# EAGLE schematic amyboardr4 (EAGLE 9.6.2)
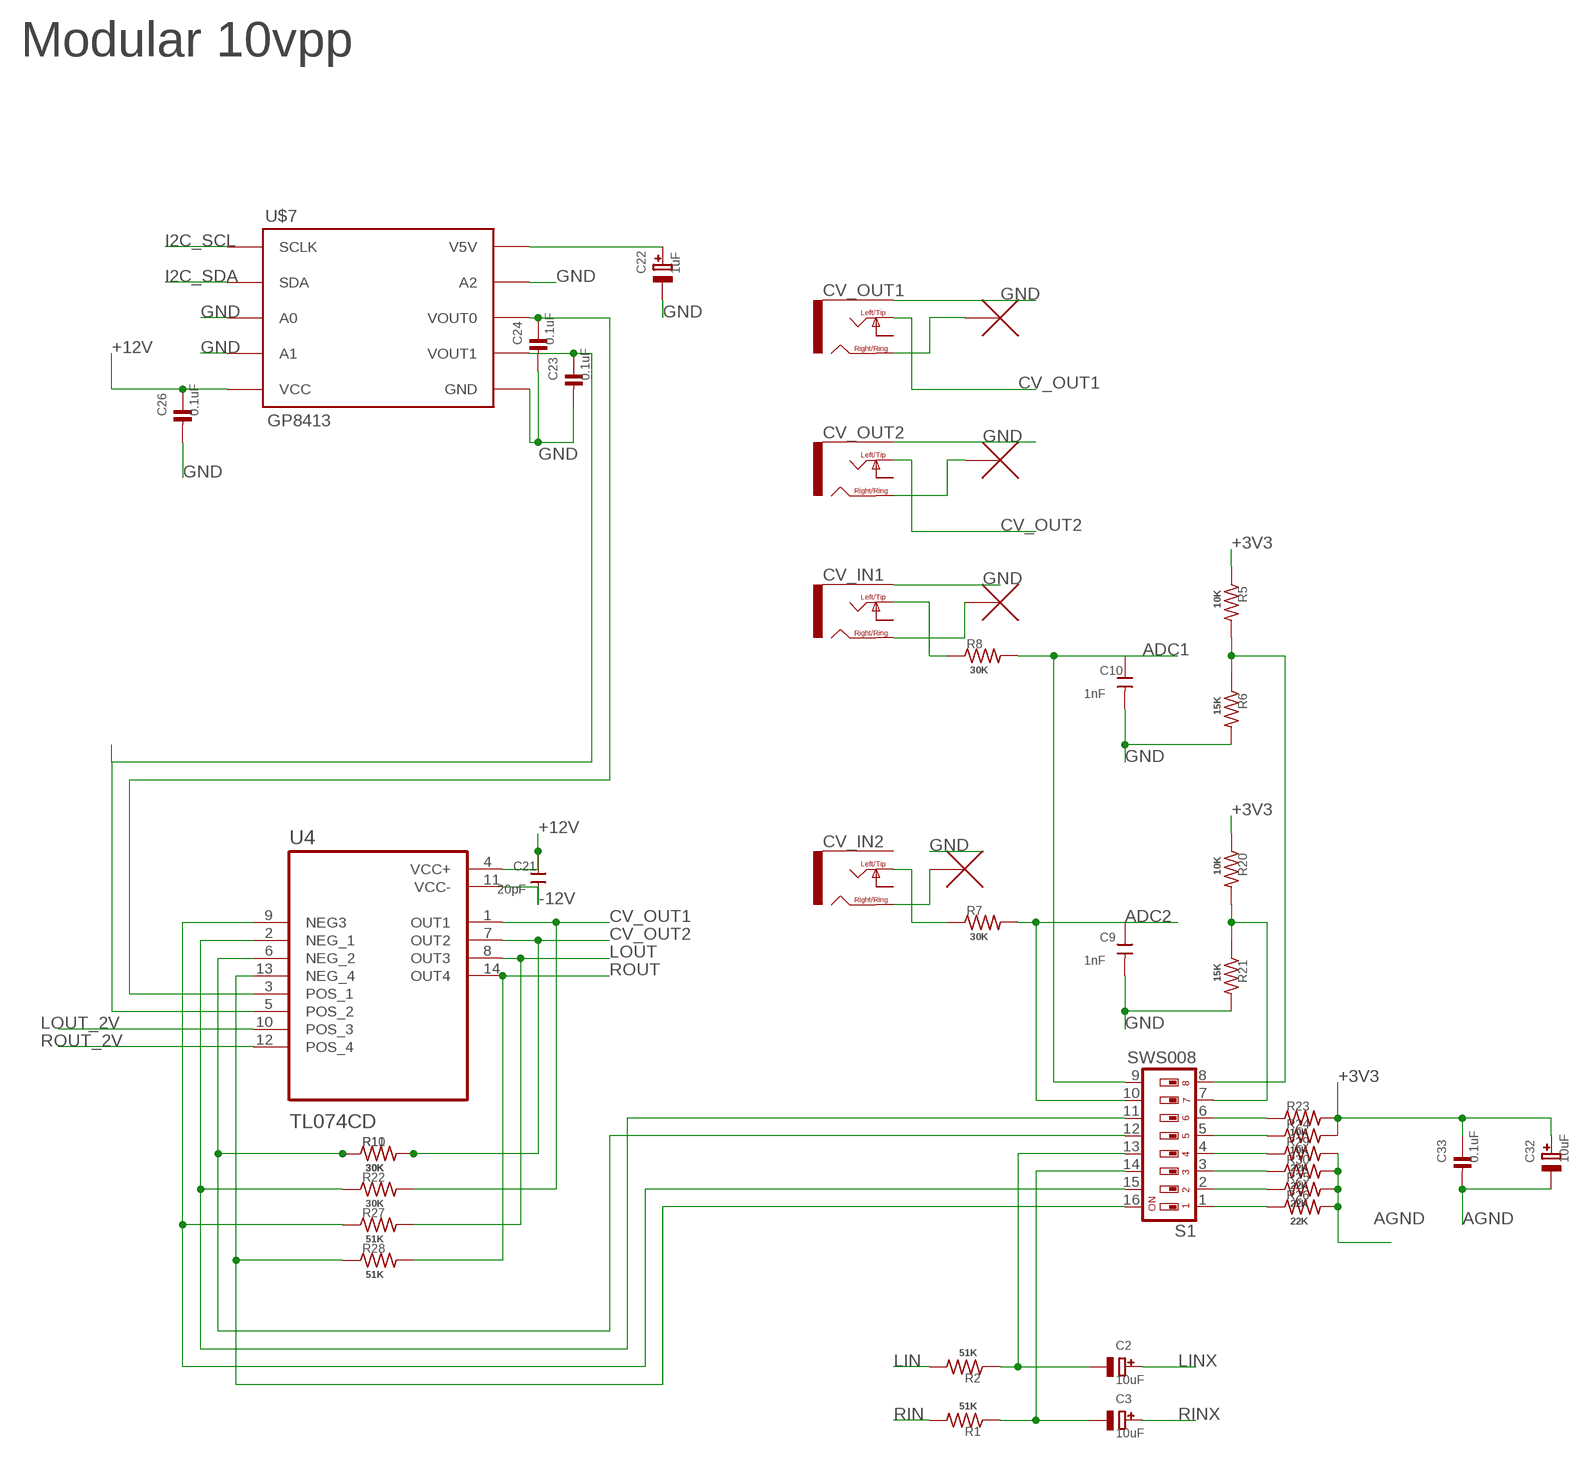
[diagram p0: schematic, sheet 1, part 1 of 2]
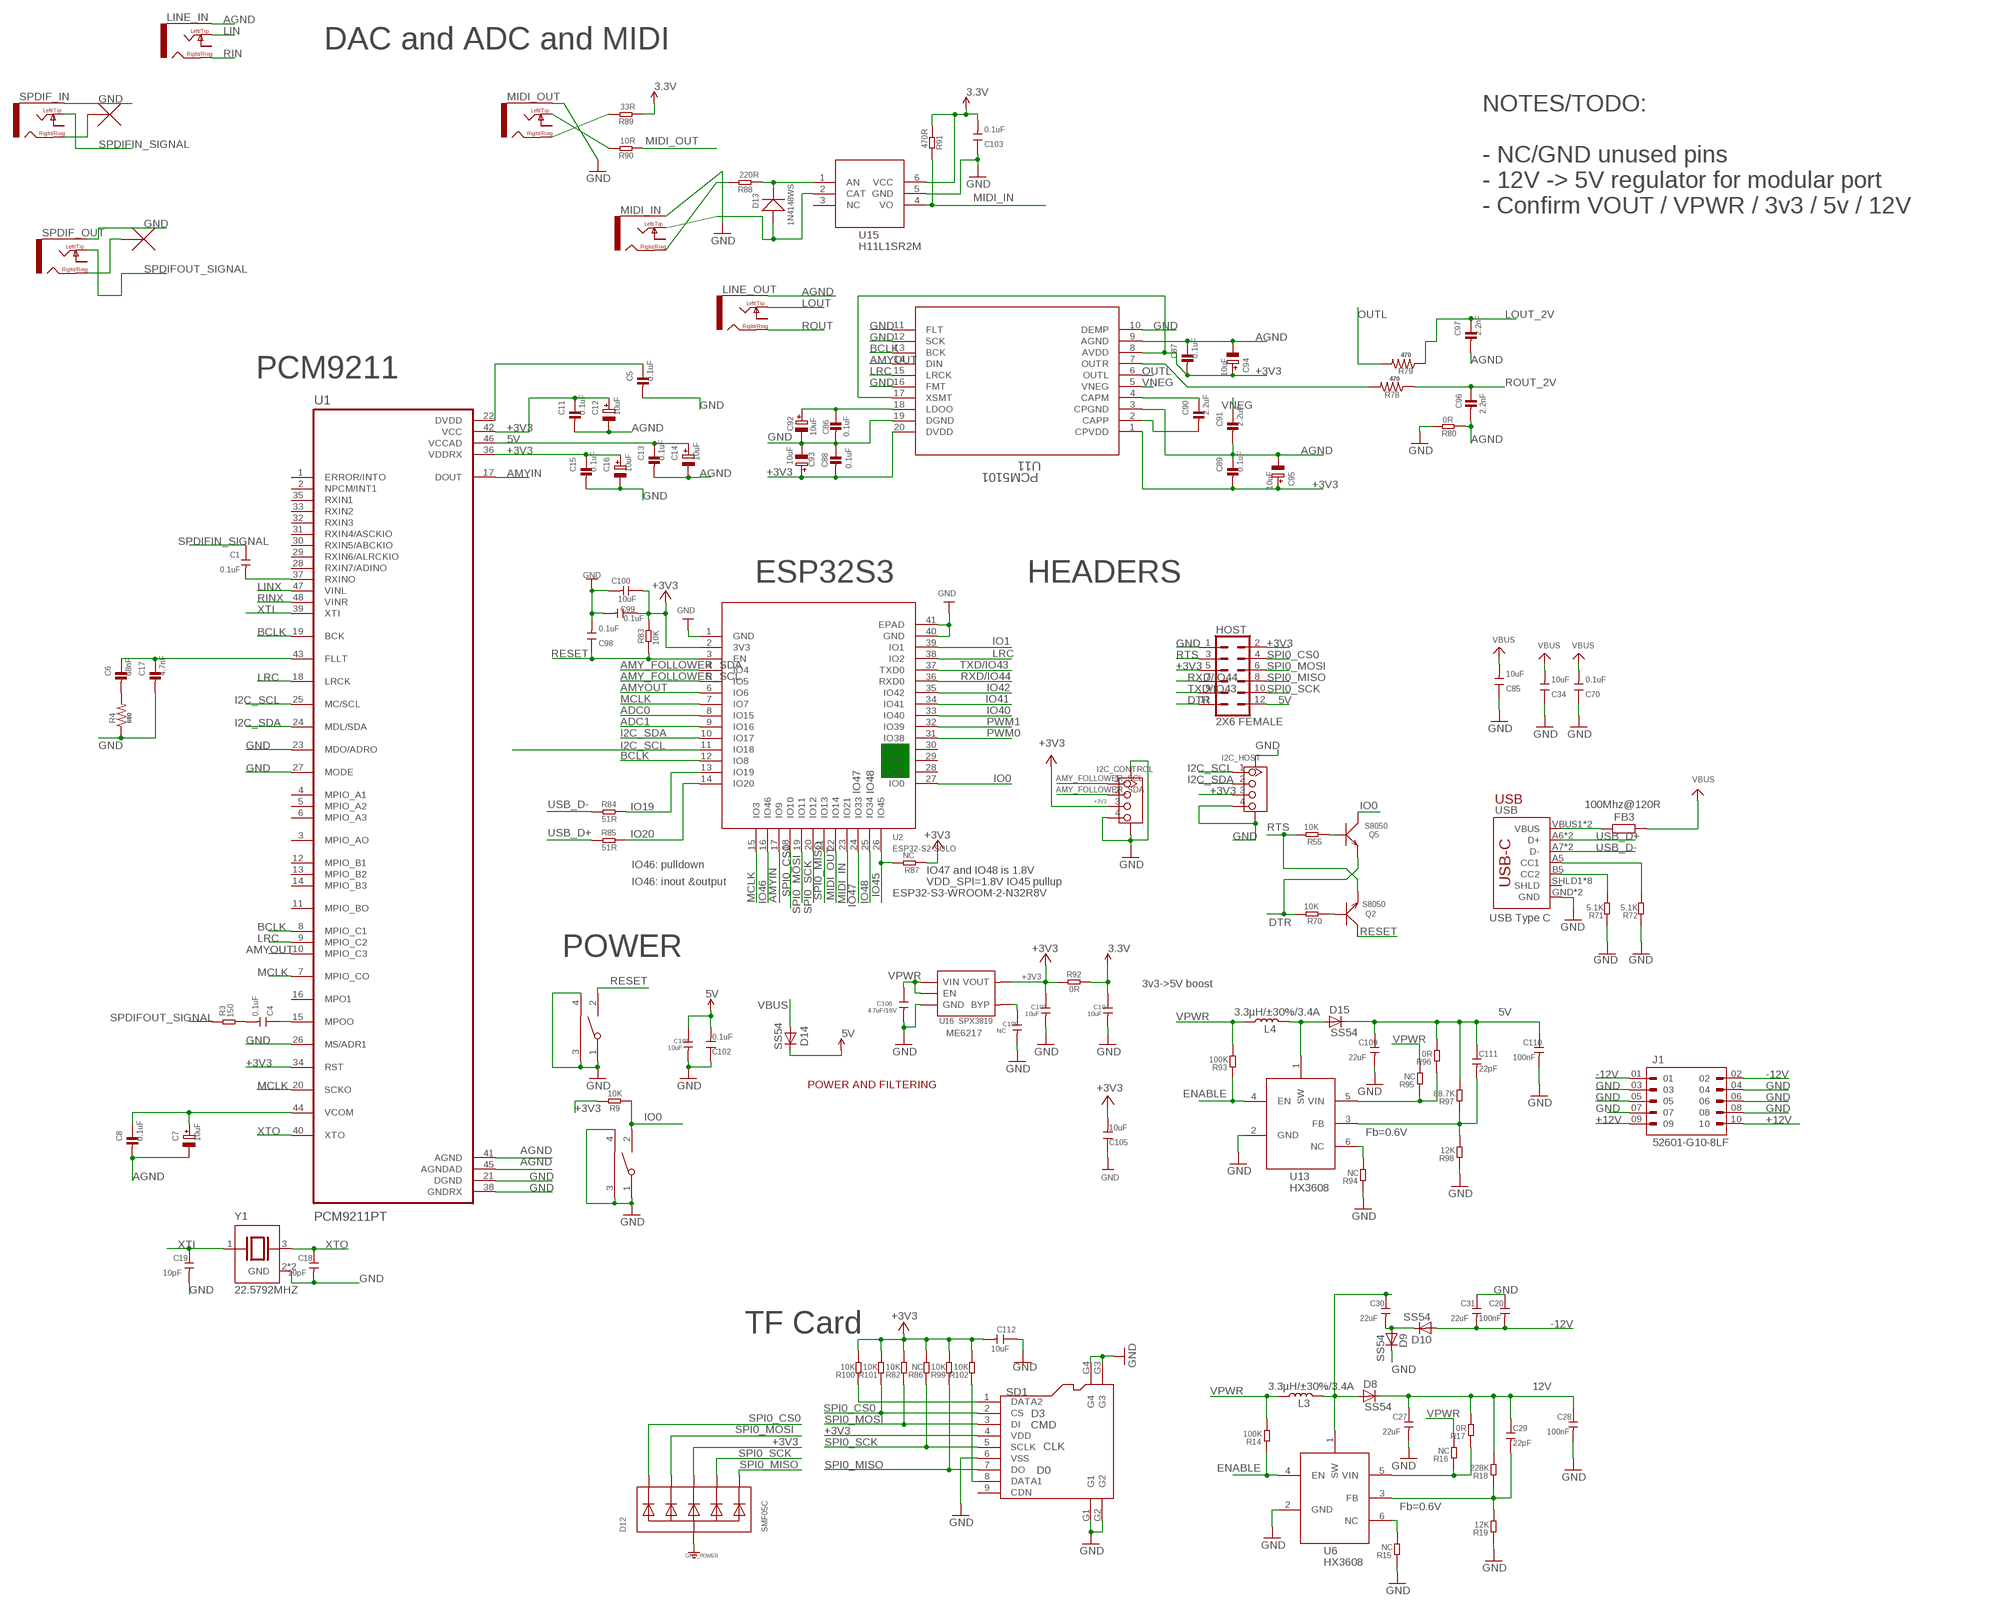
[diagram p1: schematic, sheet 1, part 2 of 2]

## Parts
BOOT  TS24CA  [2*4*3.5MM]
C1  0.1uF  CAP-0603  [C0603]
C2  10uF  CAP_ELECTROLYTICPANASONIC_C  [PANASONIC_C]
C3  10uF  CAP_ELECTROLYTICPANASONIC_C  [PANASONIC_C]
C4  0.1uF  CAP-0603  [C0603]
C5  0.1uF  CAP_CERAMIC0805-NOOUTLINE  [0805-NO@1]
C6  68nF  CAP_CERAMIC0805-NOOUTLINE  [0805-NO@1]
C7  10uF  CAP_ELECTROLYTICPANASONIC_C  [PANASONIC_C]
C8  0.1uF  CAP_CERAMIC0805-NOOUTLINE  [0805-NO@1]
C9  1nF  CAP-0603  [C0603]
C10  1nF  CAP-0603  [C0603]
C11  0.1uF  CAP_CERAMIC0805-NOOUTLINE  [0805-NO@1]
C12  10uF  CAP_ELECTROLYTICPANASONIC_C  [PANASONIC_C]
C13  0.1uF  CAP_CERAMIC0805-NOOUTLINE  [0805-NO@1]
C14  10uF  CAP_ELECTROLYTICPANASONIC_C  [PANASONIC_C]
C15  0.1uF  CAP_CERAMIC0805-NOOUTLINE  [0805-NO@1]
C16  10uF  CAP_ELECTROLYTICPANASONIC_C  [PANASONIC_C]
C17  4.7nF  CAP_CERAMIC0805-NOOUTLINE  [0805-NO@1]
C18  10pF  CAP-0603  [C0603]
C19  10pF  CAP-0603  [C0603]
C20  100nF  CAP-0603  [C0603]
C21  20pF  CAP-0603  [C0603]
C22  1uF  CAP_ELECTROLYTICPANASONIC_C  [PANASONIC_C]
C23  0.1uF  CAP_CERAMIC0805-NOOUTLINE  [0805-NO@1]
C24  0.1uF  CAP_CERAMIC0805-NOOUTLINE  [0805-NO@1]
C26  0.1uF  CAP_CERAMIC0805-NOOUTLINE  [0805-NO@1]
C27  22uF  CAP-0603  [C0603]
C28  100nF  CAP-0603  [C0603]
C29  22pF  CAP-0603  [C0603]
C30  22uF  CAP-0603  [C0603]
C31  22uF  CAP-0603  [C0603]
C32  10uF  CAP_ELECTROLYTICPANASONIC_C  [PANASONIC_C]
C33  0.1uF  CAP_CERAMIC0805-NOOUTLINE  [0805-NO@1]
C34  10uF  DISCRETE_C-0603  [DISCRETE_C0603]
C70  0.1uF  DISCRETE_C-0603  [DISCRETE_C0603]
C85  10uF  DISCRETE_C-0603  [DISCRETE_C0603]
C86  0.1uF  CAP_CERAMIC0805-NOOUTLINE  [0805-NO@1]
C87  0.1uF  CAP_CERAMIC0805-NOOUTLINE  [0805-NO@1]
C88  0.1uF  CAP_CERAMIC0805-NOOUTLINE  [0805-NO@1]
C89  0.1uF  CAP_CERAMIC0805-NOOUTLINE  [0805-NO@1]
C90  2.2uF  CAP_CERAMIC0805-NOOUTLINE  [0805-NO@1]
C91  2.2uF  CAP_CERAMIC0805-NOOUTLINE  [0805-NO@1]
C92  10uF  CAP_ELECTROLYTICPANASONIC_C  [PANASONIC_C]
C93  10uF  CAP_ELECTROLYTICPANASONIC_C  [PANASONIC_C]
C94  10uF  CAP_ELECTROLYTICPANASONIC_C  [PANASONIC_C]
C95  10uF  CAP_ELECTROLYTICPANASONIC_C  [PANASONIC_C]
C96  2.2nF  CAP_CERAMIC0805-NOOUTLINE  [0805-NO@1]
C97  2.2nF  CAP_CERAMIC0805-NOOUTLINE  [0805-NO@1]
C98  0.1uF  DISCRETE_C-0603  [DISCRETE_C0603]
C99  0.1uF  DISCRETE_C-0603  [DISCRETE_C0603]
C100  10uF  DISCRETE_C-0603  [DISCRETE_C0603]
C101  10uF  C-0603  [0603]
C102  0.1uF  DISCRETE_C-0603  [DISCRETE_C0603]
C103  0.1uF  DISCRETE_C-0603  [DISCRETE_C0603]
C104  10uF  C-0603  [0603]
C105  10uF  DISCRETE_C-0603  [DISCRETE_C0603]
C106  4.7uF/16V  C-0603  [0603]
C107  10uF  C-0603  [0603]
C108  NC  C-0603  [0603]
C109  22uF  CAP-0603  [C0603]
C110  100nF  CAP-0603  [C0603]
C111  22pF  CAP-0603  [C0603]
C112  10uF  DISCRETE_C-0603  [DISCRETE_C0603]
CV_IN1  NV-PJ3410_STEREO  [NV-PJ3410_SOCKET]
CV_IN2  NV-PJ3410_STEREO  [NV-PJ3410_SOCKET]
CV_OUT1  NV-PJ3410_STEREO  [NV-PJ3410_SOCKET]
CV_OUT2  NV-PJ3410_STEREO  [NV-PJ3410_SOCKET]
D8  SS54  DIODE-DO-214AC  [DO-214AC]
D9  SS54  DIODE-DO-214AC  [DO-214AC]
D10  SS54  DIODE-DO-214AC  [DO-214AC]
D12  SMF05C  TVSARRAY_5LANE  [SOT363]
D13  1N4148WS  D'0805'  [SOD323]
D14  SS54  DIODE-DO-214AC  [DO-214AC]
D15  SS54  DIODE-DO-214AC  [DO-214AC]
FB3  100Mhz@120R  R-EU_R0805  [R0805]
HOST  2X6 FEMALE  CONN_06X2PTH_FEMALE  [2X6]
I2C_CONTROL  GROVE-CONNECTOR-SMD'90D'  [HW4-SMD-2.0-90D]
I2C_HOST  GROVE-CONNECTOR-SMD'90D'  [HW4-SMD-2.0-90D]
J1  52601-G10-8LF  [AMPHENOL_52601-G10-8LF]
L3  3.3µH/±30%/3.4A  INDUCTOR-CR54-3.3UH  [CR54]
L4  3.3µH/±30%/3.4A  INDUCTOR-CR54-3.3UH  [CR54]
LINE_IN  NV-PJ3410_STEREO  [NV-PJ3410_SOCKET]
LINE_OUT  NV-PJ3410_STEREO  [NV-PJ3410_SOCKET]
MIDI_IN  NV-PJ3410_STEREO  [NV-PJ3410_SOCKET]
MIDI_OUT  NV-PJ3410_STEREO  [NV-PJ3410_SOCKET]
PCM5101  U11  PCM5101APW  [PW20_TEX]
Q2  S8050  TRANSISTOR-NPN-SOT23  [SOT23]
Q5  S8050  TRANSISTOR-NPN-SOT23  [SOT23]
R1  51K  R-US_R0805  [R0805]
R2  51K  R-US_R0805  [R0805]
R3  150  DISCRETE_R-0603  [DISCRETE_R0603]
R4  680  R-US_R0805  [R0805]
R5  10K  R-US_R0805  [R0805]
R6  15K  R-US_R0805  [R0805]
R7  30K  R-US_R0805  [R0805]
R8  30K  R-US_R0805  [R0805]
R9  10K  R-0603  [R0603]
R10  30K  R-US_R0805  [R0805]
R11  30K  R-US_R0805  [R0805]
R14  100K  DISCRETE_R-0603  [DISCRETE_R0603]
R15  NC  DISCRETE_R-0603  [DISCRETE_R0603]
R16  NC  DISCRETE_R-0603  [DISCRETE_R0603]
R17  0R  DISCRETE_R-0603  [DISCRETE_R0603]
R18  228K  DISCRETE_R-0603  [DISCRETE_R0603]
R19  12K  DISCRETE_R-0603  [DISCRETE_R0603]
R20  10K  R-US_R0805  [R0805]
R21  15K  R-US_R0805  [R0805]
R22  30K  R-US_R0805  [R0805]
R23  10K  R-US_R0805  [R0805]
R24  10K  R-US_R0805  [R0805]
R25  22K  R-US_R0805  [R0805]
R26  22K  R-US_R0805  [R0805]
R27  51K  R-US_R0805  [R0805]
R28  51K  R-US_R0805  [R0805]
R29  22K  R-US_R0805  [R0805]
R30  22K  R-US_R0805  [R0805]
R55  10K  R-0603  [R0603]
R70  10K  R-0603  [R0603]
R71  5.1K  DISCRETE_R-0603  [DISCRETE_R0603]
R72  5.1K  DISCRETE_R-0603  [DISCRETE_R0603]
R78  470  R-US_R0805  [R0805]
R79  470  R-US_R0805  [R0805]
R80  0R  DISCRETE_R-0603  [DISCRETE_R0603]
R82  10K  DISCRETE_R-0603  [DISCRETE_R0603]
R83  10K  R-0603  [R0603]
R84  51R  R-0603  [R0603]
R85  51R  R-0603  [R0603]
R86  NC  DISCRETE_R-0603  [DISCRETE_R0603]
R87  NC  R-0603  [R0603]
R88  220R  R-0603  [R0603]
R89  33R  R-0603  [R0603]
R90  10R  R-0603  [R0603]
R91  470R  R-0603  [R0603]
R92  0R  R-0603  [R0603]
R93  100K  DISCRETE_R-0603  [DISCRETE_R0603]
R94  NC  DISCRETE_R-0603  [DISCRETE_R0603]
R95  NC  DISCRETE_R-0603  [DISCRETE_R0603]
R96  0R  DISCRETE_R-0603  [DISCRETE_R0603]
R97  88.7K  DISCRETE_R-0603  [DISCRETE_R0603]
R98  12K  DISCRETE_R-0603  [DISCRETE_R0603]
R99  10K  DISCRETE_R-0603  [DISCRETE_R0603]
R100  10K  DISCRETE_R-0603  [DISCRETE_R0603]
R101  10K  DISCRETE_R-0603  [DISCRETE_R0603]
R102  10K  DISCRETE_R-0603  [DISCRETE_R0603]
RST  TS24CA  [2*4*3.5MM]
S1  SWS008  [SMS-008]
SD1  HOLDER-MICROSD-9P  [9P-SMD-W/-RING]
SPDIF_IN  NV-PJ3410_STEREO  [NV-PJ3410_SOCKET]
SPDIF_OUT  NV-PJ3410_STEREO  [NV-PJ3410_SOCKET]
U1  PCM9211PT  [QFP50P900X900X160-48N]
U2  ESP32­S2­SOLO  [ESP32-­S2-­SOLO]
U4  TL074CD  [SOIC127P600X175-14N]
U6  HX3608  [SOT-23-6]
U13  HX3608  [SOT-23-6]
U15  H11L1SR2M  [SOP-6-2.54MM]
U16  SPX3819  [SOT23-5]
U$1  NC_MARKER  (no package)
U$2  NC_MARKER  (no package)
U$3  NC_MARKER  (no package)
U$4  NC_MARKER  (no package)
U$5  NC_MARKER  (no package)
U$6  NC_MARKER  (no package)
U$7  GP8413  [SOIC-10]
USB  USB_C5  [USB-C-16P-5]
Y1  22.5792MHZ  ABM10W-22.5792MHZ-8-K1Z-T3  [XTAL_ABM10W-22.5792MHZ-8-K1Z-T3]

## Nets
3.3V: C103.2 C104.1 R89.1 R91.1 R92.2 U15.6(VCC)
5V: C13.1 C14.+ C101.1 C102.2 C109.1 C110.1 C111.1 D14.C D15.C HOST.12 R96.2 R97.2 U1.46(VCCAD)
12V: C27.1 C28.1 C29.1 D8.C R17.2 R18.2
+3V3: C5.1 C11.1 C12.+ C15.1 C16.+ C32.+ C33.1 C87.2 C88.2 C89.2 C93.+ C94.+ C95.+ C99.1 C100.1 C105.2 C107.1 C112.2 D12.4(C3) HOST.2 HOST.5 I2C_CONTROL.3 I2C_HOST.3 PCM5101.1(CPVDD) PCM5101.8(AVDD) PCM5101.17(XSMT) PCM5101.20(DVDD) R5.1 R9.2 R20.1 R23.2 R24.2 R82.2 R83.2 R86.2 R87.1 R92.1 R99.2 R100.2 R101.2 R102.2 SD1.4(VDD) U1.22(DVDD) U1.34(RST) U1.36(VDDRX) U1.42(VCC) U2.2(3V3) U16.5(VOUT)
+12V: C21.1 C26.1 J1.09 J1.10 U4.4(VCC+) U$7.5(VCC)
-12V: C20.2 C21.2 C31.2 D10.A J1.01 J1.02 U4.11(VCC-)
ADC0: U2.8(IO15)
ADC1: C10.1 R8.2 S1.9 U2.9(IO16)
ADC2: C9.1 R7.2 S1.10
AGND: C7.- C8.2 C11.2 C12.- C13.2 C14.- C32.- C33.2 C87.1 C89.1 C91.2 C94.- C95.- C96.2 C97.2 LINE_IN.GND(EARTH) LINE_OUT.GND(EARTH) PCM5101.3(CPGND) PCM5101.9(AGND) R25.2 R26.2 R29.2 R30.2 R80.1 U1.41(AGND) U1.45(AGNDAD)
AMY_FOLLOWER_SCL: I2C_CONTROL.1 U2.5(IO5)
AMY_FOLLOWER_SDA: I2C_CONTROL.2 U2.4(IO4)
AMYIN: U1.17(DOUT) U2.17(IO9)
AMYOUT: PCM5101.14(DIN) U1.10(MPIO_C3) U2.6(IO6)
BCLK: PCM5101.13(BCK) U1.8(MPIO_C1) U1.19(BCK) U2.12(IO8)
CV_OUT1: CV_OUT1.LEFT/TIP(TIP) R22.2 U4.1(OUT1)
CV_OUT2: CV_OUT2.LEFT/TIP(TIP) R10.2 R11.2 U4.7(OUT2)
DTR: HOST.11 Q5.2(E) R70.2
ENABLE: R14.1 R93.1 U6.4(EN) U13.4(EN)
GND: BOOT.1 BOOT.3 BOOT.4 C5.2 C9.2 C10.2 C15.2 C16.- C17.2 C18.2 C19.2 C20.1 C22.- C23.2 C24.2 C26.2 C27.2 C28.2 C31.1 C34.1 C70.1 C85.1 C86.2 C88.1 C92.- C93.- C98.2 C99.2 C100.2 C101.2 C102.1 C103.1 C104.2 C105.1 C106.2 C107.2 C108.2 C109.2 C110.2 C112.1 CV_IN1.GND(EARTH) CV_OUT1.GND(EARTH) CV_OUT2.GND(EARTH) D9.C D12.2(A) HOST.1 I2C_CONTROL.4 I2C_CONTROL.SS1 I2C_CONTROL.SS2 I2C_HOST.4 I2C_HOST.SS1 I2C_HOST.SS2 J1.03 J1.04 J1.05 J1.06 J1.07 J1.08 MIDI_IN.GND(EARTH) MIDI_OUT.GND(EARTH) PCM5101.10(DEMP) PCM5101.11(FLT) PCM5101.12(SCK) PCM5101.16(FMT) PCM5101.19(DGND) R4.1 R6.2 R15.1 R19.1 R21.2 R71.1 R72.1 R80.2 R94.1 R98.1 RST.1 RST.3 RST.4 SD1.6(VSS) SD1.G1 SD1.G2 SD1.G3 SD1.G4 SPDIF_IN.GND(EARTH) SPDIF_OUT.GND(EARTH) U1.21(DGND) U1.23(MDO/ADRO) U1.26(MS/ADR1) U1.27(MODE) U1.38(GNDRX) U2.1(GND) U2.40(GND) U2.41(EPAD) U6.2(GND) U13.2(GND) U15.5(GND) U16.2(GND) U$7.3(A0) U$7.4(A1) U$7.6(GND) U$7.9(A2) USB.GND USB.GND2(GND) Y1.2(GND) Y1.4(GND) ; supply symbol labelled GND_POWER
I2C_SCL: I2C_HOST.1 U1.25(MC/SCL) U2.11(IO18) U$7.1(SCLK)
I2C_SDA: I2C_HOST.2 U1.24(MDL/SDA) U2.10(IO17) U$7.2(SDA)
IO0: BOOT.2 Q5.3(C) R9.1 U2.27(IO0)
IO1: U2.39(IO1)
IO19: R84.2 U2.13(IO19)
IO20: R85.2 U2.14(IO20)
IO40: U2.33(IO40)
IO41: U2.34(IO41)
IO42: U2.35(IO42)
IO45: R87.2 U2.26(IO45)
IO46: U2.16(IO46)
IO47: U2.24(IO33)
IO48: U2.25(IO34)
LIN: LINE_IN.LEFT/TIP(TIP) R2.2
LINX: C2.+ U1.47(VINL)
LOUT: LINE_OUT.LEFT/TIP(TIP) R27.2 U4.8(OUT3)
LOUT_2V: C97.1 R79.1 U4.10(POS_3)
LRC: PCM5101.15(LRCK) U1.9(MPIO_C2) U1.18(LRCK) U2.38(IO2)
MCLK: U1.7(MPIO_CO) U1.20(SCKO) U2.7(IO7) U2.15(IO3)
MIDI_IN: R91.2 U2.23(IO21) U15.4(VO)
MIDI_OUT: R90.1 U2.22(IO14)
N$1: C1.2 U1.37(RXINO)
N$2: C4.2 R3.2
N$3: C4.1 U1.15(MPOO)
N$4: C2.- R2.1 S1.13
N$5: C3.- R1.1 S1.14
N$6: C7.+ C8.1 U1.44(VCOM)
N$7: C6.1 C17.1 U1.43(FLLT)
N$8: C6.2 R4.2
N$9: SPDIF_OUT.RIGHT/RING(RING) U$1.P$1
N$10: SPDIF_IN.RIGHT/RING(RING) U$2.P$1
N$11: CV_OUT1.RIGHT/RING(RING) U$3.P$1
N$12: CV_OUT2.RIGHT/RING(RING) U$4.P$1
N$13: CV_IN1.RIGHT/RING(RING) U$5.P$1
N$14: CV_IN2.RIGHT/RING(RING) U$6.P$1
N$15: R20.2 R21.1 S1.7
N$16: R5.2 R6.1 S1.8
N$17: CV_IN1.LEFT/TIP(TIP) R8.1
N$18: C24.1 U4.3(POS_1) U$7.8(VOUT0)
N$19: CV_IN2.LEFT/TIP(TIP) R7.1
N$20: C23.1 U4.5(POS_2) U$7.7(VOUT1)
N$21: C30.1 D8.A L3.P$2 U6.1(SW)
N$22: C22.+ U$7.10(V5V)
N$26: C29.2 R18.1 R19.2 U6.3(FB)
N$27: R15.2 U6.6(NC)
N$28: R16.1 R17.1 U6.5(VIN)
N$29: C30.2 D9.A D10.C
N$30: R23.1 S1.6
N$31: R10.1 R11.1 S1.12 U4.6(NEG_2)
N$32: R24.1 S1.5
N$33: R22.1 S1.11 U4.2(NEG_1)
N$34: Q2.1(B) R70.1
N$35: R26.1 S1.1
N$36: R25.1 S1.2
N$37: Q5.1(B) R55.1
N$38: R72.2 USB.A5(CC1)
N$39: R71.2 USB.B5(CC2)
N$40: R29.1 S1.4
N$41: R30.1 S1.3
N$42: FB3.1 USB.VBUS1(VBUS) USB.VBUS2(VBUS)
N$44: R27.1 S1.15 U4.9(NEG3)
N$45: R28.1 S1.16 U4.13(NEG_4)
N$48: C86.1 C92.+ PCM5101.18(LDOO)
N$50: PCM5101.7(OUTR) R78.2
N$51: C90.1 PCM5101.4(CAPM)
N$52: C90.2 PCM5101.2(CAPP)
N$55: D13.+ MIDI_IN.LEFT/TIP(TIP) U15.2(CAT)
N$56: MIDI_IN.RIGHT/RING(RING) R88.2
N$57: D13.- R88.1 U15.1(AN)
N$58: MIDI_OUT.LEFT/TIP(TIP) R90.2
N$59: MIDI_OUT.RIGHT/RING(RING) R89.2
N$60: C108.1 U16.4(BYP)
N$65: D15.A L4.P$2 U13.1(SW)
N$66: C111.2 R97.1 R98.2 U13.3(FB)
N$67: R94.2 U13.6(NC)
N$68: R95.1 R96.1 U13.5(VIN)
N$75: R100.1 SD1.1(DATA2)
N$77: R102.1 SD1.8(DATA1)
OUTL: PCM5101.6(OUTL) R79.2
PWM0: U2.31(IO38)
PWM1: U2.32(IO39)
RESET: C98.1 Q2.3(C) R83.1 RST.2 U2.3(EN)
RIN: LINE_IN.RIGHT/RING(RING) R1.2
RINX: C3.+ U1.48(VINR)
ROUT: LINE_OUT.RIGHT/RING(RING) R28.2 U4.14(OUT4)
ROUT_2V: C96.1 R78.1 U4.12(POS_4)
RTS: HOST.3 Q2.2(E) R55.2
RXD/IO44: HOST.7 U2.36(RXD0)
SPDIFIN_SIGNAL: C1.1 SPDIF_IN.LEFT/TIP(TIP)
SPDIFOUT_SIGNAL: R3.1 SPDIF_OUT.LEFT/TIP(TIP)
SPI0_CS0: D12.1(C1) HOST.4 R101.1 SD1.2(CS) U2.18(IO10)
SPI0_MISO: D12.6(C5) HOST.8 R99.1 SD1.7(DO) U2.21(IO13)
SPI0_MOSI: D12.3(C2) HOST.6 R82.1 SD1.3(DI) U2.19(IO11)
SPI0_SCK: D12.5(C4) HOST.10 R86.1 SD1.5(SCLK) U2.20(IO12)
TXD/IO43: HOST.9 U2.37(TXD0)
USB_D+: R85.1 USB.A6(D+) USB.B6(D+)
USB_D-: R84.1 USB.A7(D-) USB.B7(D-)
VBUS: C34.2 C70.2 C85.2 D14.A FB3.2
VNEG: C91.1 PCM5101.5(VNEG)
VPWR: C106.1 L3.P$1 L4.P$1 R14.2 R16.2 R93.2 R95.2 U16.1(VIN) U16.3(EN)
XTI: C19.1 U1.39(XTI) Y1.1
XTO: C18.1 U1.40(XTO) Y1.3
Unconnected: CV_IN1.SWITCH(TIP-NORM) CV_IN2.GND(EARTH) CV_IN2.SWITCH(TIP-NORM) CV_OUT1.SWITCH(TIP-NORM) CV_OUT2.SWITCH(TIP-NORM) LINE_IN.SWITCH(TIP-NORM) LINE_OUT.SWITCH(TIP-NORM) MIDI_IN.SWITCH(TIP-NORM) MIDI_OUT.SWITCH(TIP-NORM) SD1.9(CDN) SPDIF_IN.SWITCH(TIP-NORM) SPDIF_OUT.SWITCH(TIP-NORM) U1.1(ERROR/INTO) U1.2(NPCM/INT1) U1.3(MPIO_AO) U1.4(MPIO_A1) U1.5(MPIO_A2) U1.6(MPIO_A3) U1.11(MPIO_BO) U1.12(MPIO_B1) U1.13(MPIO_B2) U1.14(MPIO_B3) U1.16(MPO1) U1.28(RXIN7/ADINO) U1.29(RXIN6/ALRCKIO) U1.30(RXIN5/ABCKIO) U1.31(RXIN4/ASCKIO) U1.32(RXIN3) U1.33(RXIN2) U1.35(RXIN1) U2.28(IO35) U2.29(IO36) U2.30(IO37) U15.3(NC) USB.SHLD1(SHLD) USB.SHLD2(SHLD) USB.SHLD3(SHLD) USB.SHLD4(SHLD) USB.SHLD5(SHLD) USB.SHLD6(SHLD) USB.SHLD7(SHLD) USB.SHLD8(SHLD)

## Notes on the sheet
- DAC and ADC and MIDI
- NOTES/TODO:
  
  - NC/GND unused pins
  - 12V -> 5V regulator for modular port
  - Confirm VOUT / VPWR / 3v3 / 5v / 12V
- PCM9211
- ESP32S3 | HEADERS
- Modular 10vpp
- IO47 | IO48
- USB
- IO46: pulldown
- IO47 and IO48 is 1.8V
- IO46: inout &output | VDD_SPI=1.8V IO45 pullup
- ESP32-S3-WROOM-2-N32R8V
- USB Type C
- POWER
- 3v3->5V boost
- ME6217
- POWER AND FILTERING
- Fb=0.6V
- TF Card
- D3
- CMD
- CLK
- D0
- Fb=0.6V

## Library data of the parts
BOOT RST = sale:TS24CA
C1 C4 C9 C10 C18-C21 C27-C31 C109-C111 = Discrete-new:CAP: Ceramic Capacitors
C2 C3 C7 C12 C14 C16 C22 C32 C92-C95 = microbuilder:CAP_ELECTROLYTIC: Electrolytic Capacitors SMT PANASONIC_C - Size C Panasonic Electrolytic Aluminum Capacitor 47µF 16V 20% Electrolytic Capacitor [Digikey: PCE3890TR-ND] PANASONIC_D - Size D Panasonic Electrolytic Aluminum Capacitor 100µF 25V 20% Electrolytic Capacitor [Digikey: PCE3898TR-ND] PTH 3.5 mm grid, 8 mm diameter ... 3.5 mm grid, 10 mm diameter ...
C5 C6 C8 C11 C13 C15 C17 C23 C24 C26 C33 C86-C91 C96 C97 = microbuilder:CAP_CERAMIC: Ceramic Capacitors For new designs, use the packages preceded by an '_' character since they are more reliable: The following footprints should be used on most boards: _0402 - Standard footprint for regular board layouts _0603 - Standard footprint for regular board layouts _0805 - Standard footprint for regular board layouts _1206 - Standard footprint for regular board layouts For extremely tight-pitch boards where space is at a premium, the following 'micro-pitch' footprints can be used (smaller pads, no silkscreen outline, etc.): _0402MP - Micro-pitch footprint for very dense/compact boards _0603MP - Micro-pitch footprint for very dense/compact boards _0805MP - Micro-pitch footprint for very dense/compact boards _1206MP - Micro-pitch footprint for very dense/compact boards
C34 C70 C85 C98-C100 C102 C103 C105 C112 = A9G:DISCRETE_C*: Ceramic Capacitors
C101 C104 C106-C108 = Discrete:C*: Ceramic Capacitors
CV_IN1 CV_IN2 CV_OUT1 CV_OUT2 LINE_IN LINE_OUT MIDI_IN MIDI_OUT SPDIF_IN SPDIF_OUT = PJ3410_sockets:NV-PJ3410_STEREO: PJ3410 socket stereo with switch
D8-D10 D14 D15 = diode:DIODE-: DIODE
D12 = microbuilder:TVSARRAY_5LANE: Voltage Transient Suppressor Array SOT363 SMF05C - 100W 5V: Digikey - SMF05CT1GOSCT-ND
D13 = Discrete:D*
FB3 = rcl:R-EU_: RESISTOR, European symbol
HOST = SparkFun-Connectors:CONN_06X2: Multi connection point. Often used as Generic Header-pin footprint for 0.1 inch spaced/style header connections On any of the 0.1 inch spaced packages, you can populate with these: Break Away Headers - Straight <https://www.sparkfun.com/products/116> (PRT-00116) Break Away Male Headers - Right Angle <https://www.sparkfun.com/products/553> (PRT-00553) Female Headers <https://www.sparkfun.com/products/115> (PRT-00115) Break Away Headers - Machine Pin <https://www.sparkfun.com/products/117> (PRT-00117) Break Away Female Headers - Swiss Machine Pin <https://www.sparkfun.com/products/743> (PRT-00743); PROD_ID: CONN-12423
I2C_CONTROL I2C_HOST = Connector-new:GROVE-CONNECTOR-SMD: 4P-SMD-2.0:320110030;4P-SMD-2.0-90D:320110032
J1 = 52601-G10-8LF:52601-G10-8LF: Check availability <https://pricing.snapeda.com/parts/52601-G10-8LF/Amphenol%20ICC/view-part?ref=eda>; AVAILABILITY: In Stock; CHECK_PRICES: https://www.snapeda.com/parts/52601-G10-8LF/Amphenol+FCI/view-part/?ref=eda; DESCRIPTION: Conn; Rect; Header; SMT; Shroud; 2.54 mm; 2-Row; 10 Pos; Gold (30) Plate;Quickie | Amphenol FCI (Amphenol CS) 52601-G10-8LF; MF: Amphenol ICC; MP: 52601-G10-8LF; PACKAGE: None; PRICE: None; SNAPEDA_LINK: https://www.snapeda.com/parts/52601-G10-8LF/Amphenol+FCI/view-part/?ref=snap
L3 L4 = SparkFun-Coils:INDUCTOR: Inductors Resist changes in electrical current. Basically a coil of wire. SparkFun Products: SparkFun Load Cell Amplifier - HX711 <https://www.sparkfun.com/products/13879> IOIO-OTG - V2.2 <https://www.sparkfun.com/products/13613>; PROD_ID: NDUC-11157
PCM5101 = pcm5101apw:PCM5101APW; COPYRIGHT: Copyright (C) 2022 Ultra Librarian. All rights reserved.; DIGI-KEY_PART_NUMBER_1: PCM5101APW-ND; MANUFACTURER_PART_NUMBER: PCM5101APW; MFR_NAME: Texas Instruments
Q2 Q5 = Discrete:TRANSISTOR-NPN*: NPN audion
R1 R2 R4-R8 R10 R11 R20-R30 R78 R79 = adafruit:R-US_: RESISTOR, American symbol
R3 R14-R19 R71 R72 R80 R82 R86 R93-R102 = A9G:DISCRETE_R*
R9 R55 R70 R83-R85 R87-R92 = Discrete:R*
S1 = smd-special:SWS008: SMD Dip Switch 8 pol.
SD1 = Connector:HOLDER-MICROSD-9P
U1 = PCM9211PT:PCM9211PT: Check availability <https://pricing.snapeda.com/parts/PCM9211PT/Texas%20Instruments/view-part?ref=eda>; AVAILABILITY: In Stock; CHECK_PRICES: https://www.snapeda.com/parts/PCM9211PT/Texas+Instruments/view-part/?ref=eda; DESCRIPTION: 216kHz Digital Audio Interface Transceiver (DIX) with Stereo ADC and Routing; MF: Texas Instruments; MP: PCM9211PT; PACKAGE: LQFP-48 Texas Instruments; PRICE: None; SNAPEDA_LINK: https://www.snapeda.com/parts/PCM9211PT/Texas+Instruments/view-part/?ref=snap
U2 = self:ESP32­S2­SOLO
U4 = TL074CD:TL074CD: Check availability <https://pricing.snapeda.com/parts/TL074CD/Texas%20Instruments/view-part?ref=eda>; AVAILABILITY: In Stock; CHECK_PRICES: https://www.snapeda.com/parts/TL074CD/Texas+Instruments/view-part/?ref=eda; DESCRIPTION: Quad, 30-V, 3-MHz, high slew rate (13-V/µs), In to V+, JFET-input op amp; MF: Texas Instruments; MP: TL074CD; PACKAGE: SOIC-14 Texas Instruments; PRICE: None; SNAPEDA_LINK: https://www.snapeda.com/parts/TL074CD/Texas+Instruments/view-part/?ref=snap
U6 U13 = self:HX3608
U15 = sale:H11L1SR2M
U16 = IC:SPX3819
U$1-U$6 = NC_MARKER:NC_MARKER
U$7 = FL5160MX:GP8413: https://www.mouser.com/ProductDetail/ON-Semiconductor-Fairchild/FL5160MX?qs=%2fha2pyFaduhZ4yOtT1cFvr2BtPh63RpxkXQRTY8DgC4%3d Check availability <https://pricing.snapeda.com/parts/FL5160MX/onsemi/view-part?ref=eda>; AVAILABILITY: In Stock; CHECK_PRICES: https://www.snapeda.com/parts/FL5160MX/Onsemi/view-part/?ref=eda; DESCRIPTION: Optocoupler Drive 1-CH 5.5V 10-Pin SOIC N T/R; MF: onsemi; MP: FL5160MX; PACKAGE: None; PRICE: None; SNAPEDA_LINK: https://www.snapeda.com/parts/FL5160MX/Onsemi/view-part/?ref=snap
USB = USBC:USB_C: USB Type C 16Pin Connector Super Speed pins not available on the 16-pin purely SMD connector so this part is best for USB 2.0 implementations. D1 and D2 are tied together enabling D+/- no matter which way the cable is plugged into the connector. The two channel configuration pins (CC1/2) are exposed. These are normally connected to ground via 5.1k resistors but can be reconfigured for high current/high power applications.
Y1 = ABM10W-22.5792MHZ-8-K1Z-T3:ABM10W-22.5792MHZ-8-K1Z-T3: Check availability <https://pricing.snapeda.com/parts/ABM10W-22.5792MHZ-8-K1Z-T3/Abracon/view-part?ref=eda>; AVAILABILITY: In Stock; CHECK_PRICES: https://www.snapeda.com/parts/ABM10W-22.5792MHZ-8-K1Z-T3/Abracon/view-part/?ref=eda; DESCRIPTION: IoT OPTIMIZED LOW PROFILE QUARTZ CRYSTAL; MF: Abracon; MP: ABM10W-22.5792MHZ-8-K1Z-T3; PACKAGE: SMD-4 Abracon; PRICE: None; SNAPEDA_LINK: https://www.snapeda.com/parts/ABM10W-22.5792MHZ-8-K1Z-T3/Abracon/view-part/?ref=snap

## Net classes
0 default: width 0.203 mm